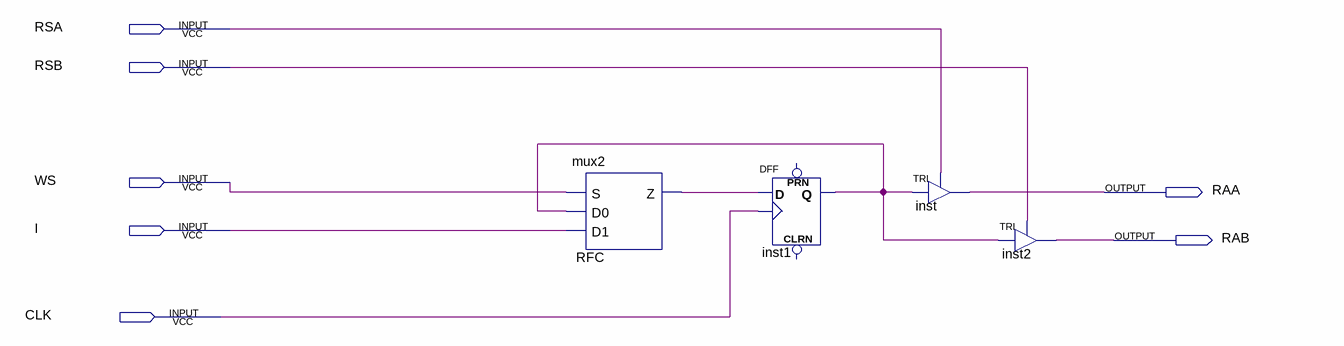
[diagram p0: schematic sheet]
// Quartus schematic RFC_1bit.bdf as structural Verilog: 4 symbols, 7 pins
module RFC_1bit (
  input  RSA,
  input  RSB,
  input  WS,
  input  I,
  input  CLK,
  output RAA,
  output RAB
);

  wire inst1_q, RFC_z;

  mux2 RFC (.S(WS), .D0(inst1_q), .D1(I), .Z(RFC_z));
  DFF inst1 (.CLK(CLK), .D(RFC_z), .Q(inst1_q));  // open: CLRN, PRN
  TRI inst (.IN(inst1_q), .OE(RSA), .OUT(RAA));
  TRI inst2 (.IN(inst1_q), .OE(RSB), .OUT(RAB));
endmodule
